# EAGLE design M111B (EAGLE 6.6.0)
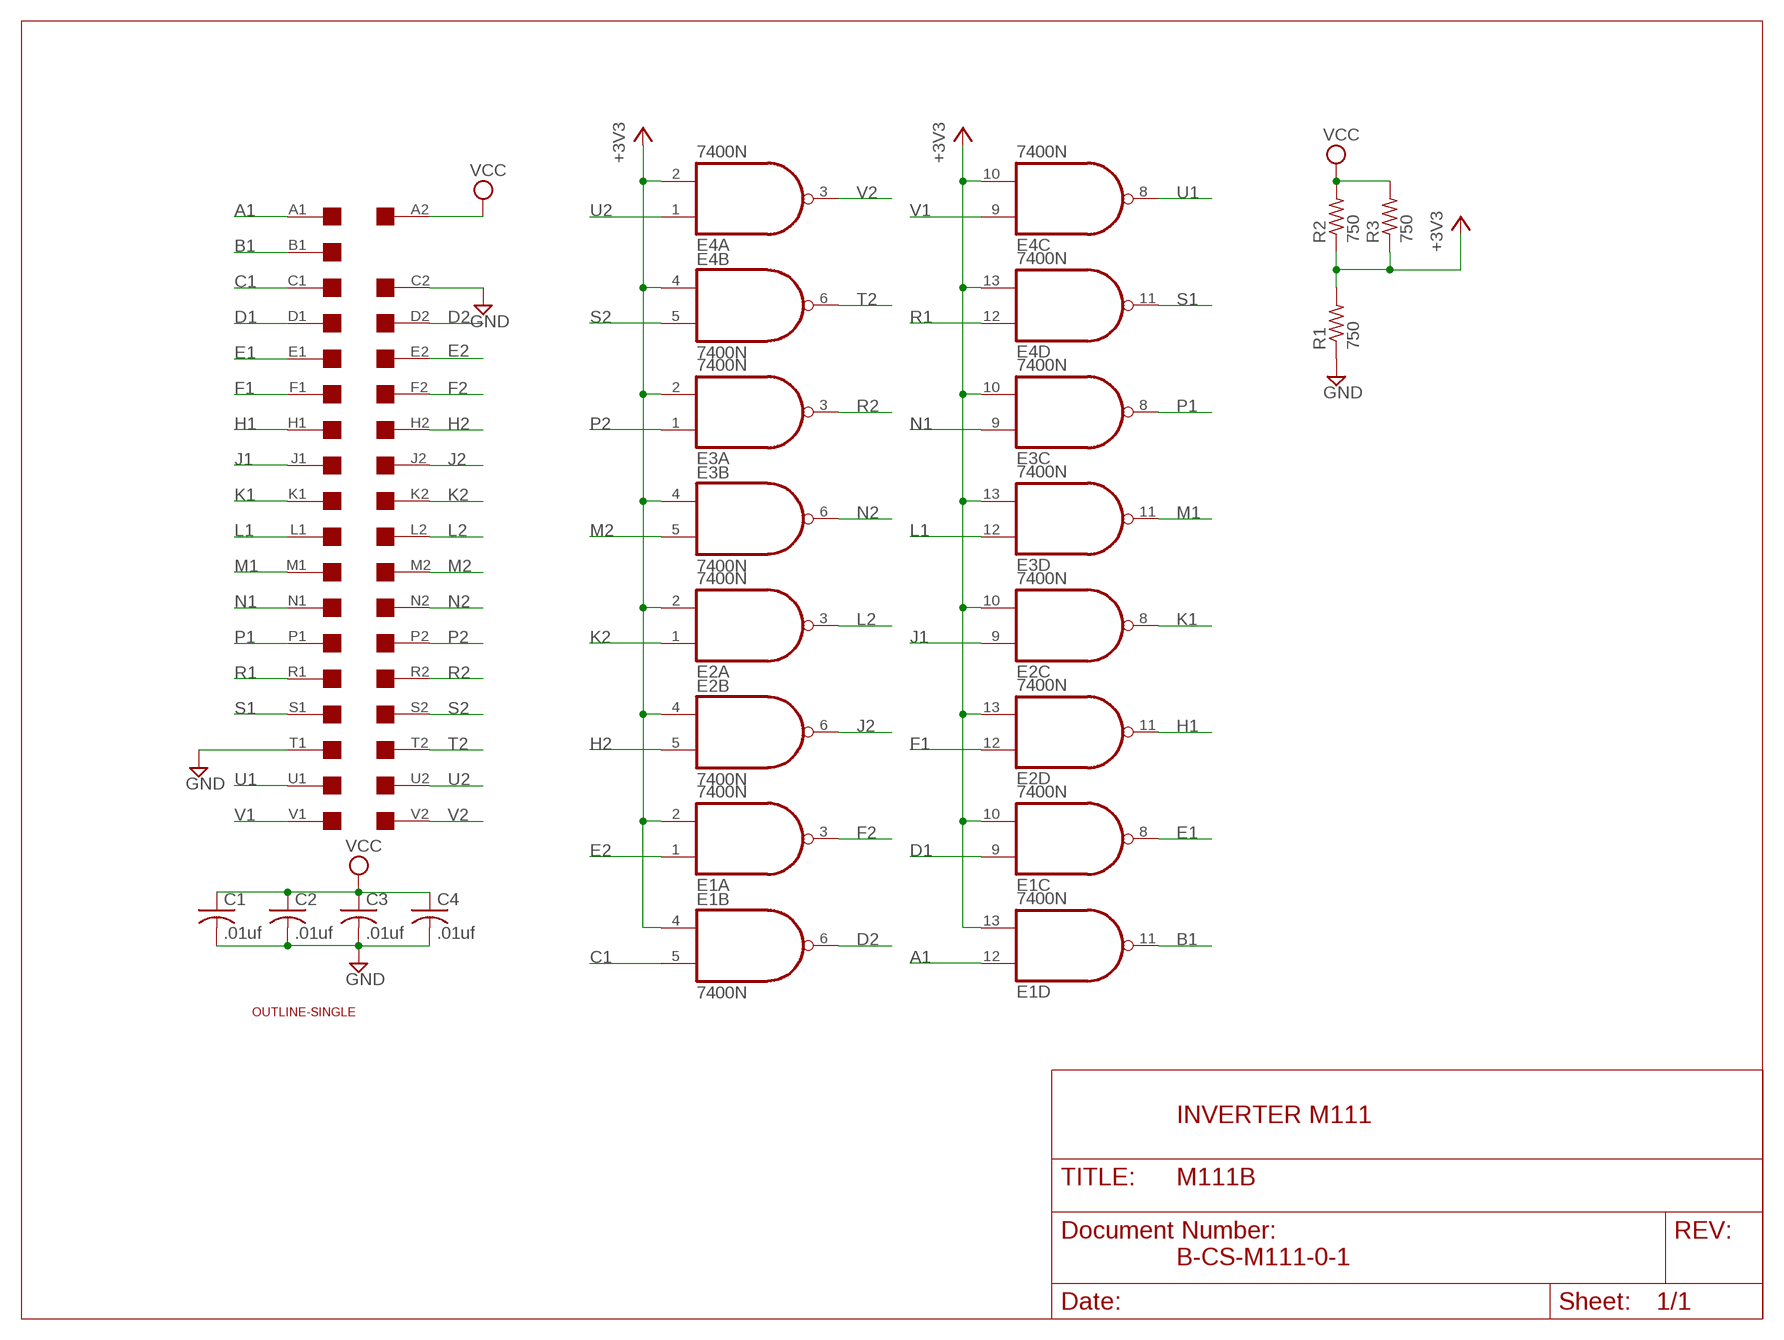
[diagram p0: schematic, sheet 1]

## Parts
A  EDGE-2CONNECTOR  [EDGE-CON2]
C1  .01uf  C-US050-025X075  [C050-025X075]
C2  .01uf  C-US050-025X075  [C050-025X075]
C3  .01uf  C-US050-025X075  [C050-025X075]
C4  .01uf  C-US050-025X075  [C050-025X075]
E1  7400N  [DIL14]
E2  7400N  [DIL14]
E3  7400N  [DIL14]
E4  7400N  [DIL14]
R1  750  R-US_0207/10  [0207/10]
R2  750  R-US_0207/10  [0207/10]
R3  750  R-US_0207/10  [0207/10]
U$1  OUTLINE-SINGLE  [SINGLE]

## Nets
+3V3: E1.2(A:I1) E1.4(B:I0) E1.10(C:I1) E1.13(D:I1) E2.2(A:I1) E2.4(B:I0) E2.10(C:I1) E2.13(D:I1) E3.2(A:I1) E3.4(B:I0) E3.10(C:I1) E3.13(D:I1) E4.2(A:I1) E4.4(B:I0) E4.10(C:I1) E4.13(D:I1) R1.2 R2.1 R3.1
A1: A.A1 E1.12(D:I0)
B1: A.B1 E1.11(D:O)
C1: A.C1 E1.5(B:I1)
D1: A.D1 E1.9(C:I0)
D2: A.D2 E1.6(B:O)
E1: A.E1 E1.8(C:O)
E2: A.E2 E1.1(A:I0)
F1: A.F1 E2.12(D:I0)
F2: A.F2 E1.3(A:O)
GND [Supply]: A.C2 A.T1 C1.2 C2.2 C3.2 C4.2 R1.1
H1: A.H1 E2.11(D:O)
H2: A.H2 E2.5(B:I1)
J1: A.J1 E2.9(C:I0)
J2: A.J2 E2.6(B:O)
K1: A.K1 E2.8(C:O)
K2: A.K2 E2.1(A:I0)
L1: A.L1 E3.12(D:I0)
L2: A.L2 E2.3(A:O)
M1: A.M1 E3.11(D:O)
M2: A.M2 E3.5(B:I1)
N1: A.N1 E3.9(C:I0)
N2: A.N2 E3.6(B:O)
P1: A.P1 E3.8(C:O)
P2: A.P2 E3.1(A:I0)
R1: A.R1 E4.12(D:I0)
R2: A.R2 E3.3(A:O)
S1: A.S1 E4.11(D:O)
S2: A.S2 E4.5(B:I1)
T2: A.T2 E4.6(B:O)
U1: A.U1 E4.8(C:O)
U2: A.U2 E4.1(A:I0)
V1: A.V1 E4.9(C:I0)
V2: A.V2 E4.3(A:O)
VCC [Supply]: A.A2 C1.1 C2.1 C3.1 C4.1 R2.2 R3.2
Unconnected: A.B2

## Notes on the sheet
- INVERTER M111
- B-CS-M111-0-1

## Power pins joined to a net without a drawn wire
GND: E1.7(P:GND) E2.7(P:GND) E3.7(P:GND) E4.7(P:GND)
VCC: E1.14(P:VCC) E2.14(P:VCC) E3.14(P:VCC) E4.14(P:VCC)

## Library data of the parts
A = dec-con:EDGE-2: Double-Sided DEC edge connector.
C1-C4 = rcl:C-US: CAPACITOR, American symbol
E1-E4 = 74xx-us:74*00: Quad 2-input NAND gate
R1-R3 = rcl:R-US_: RESISTOR, American symbol
U$1 = dec-con:OUTLINE-*: Board outlines for DEC boards.

## Net classes
1 Supply: width 0.813 mm

## Board
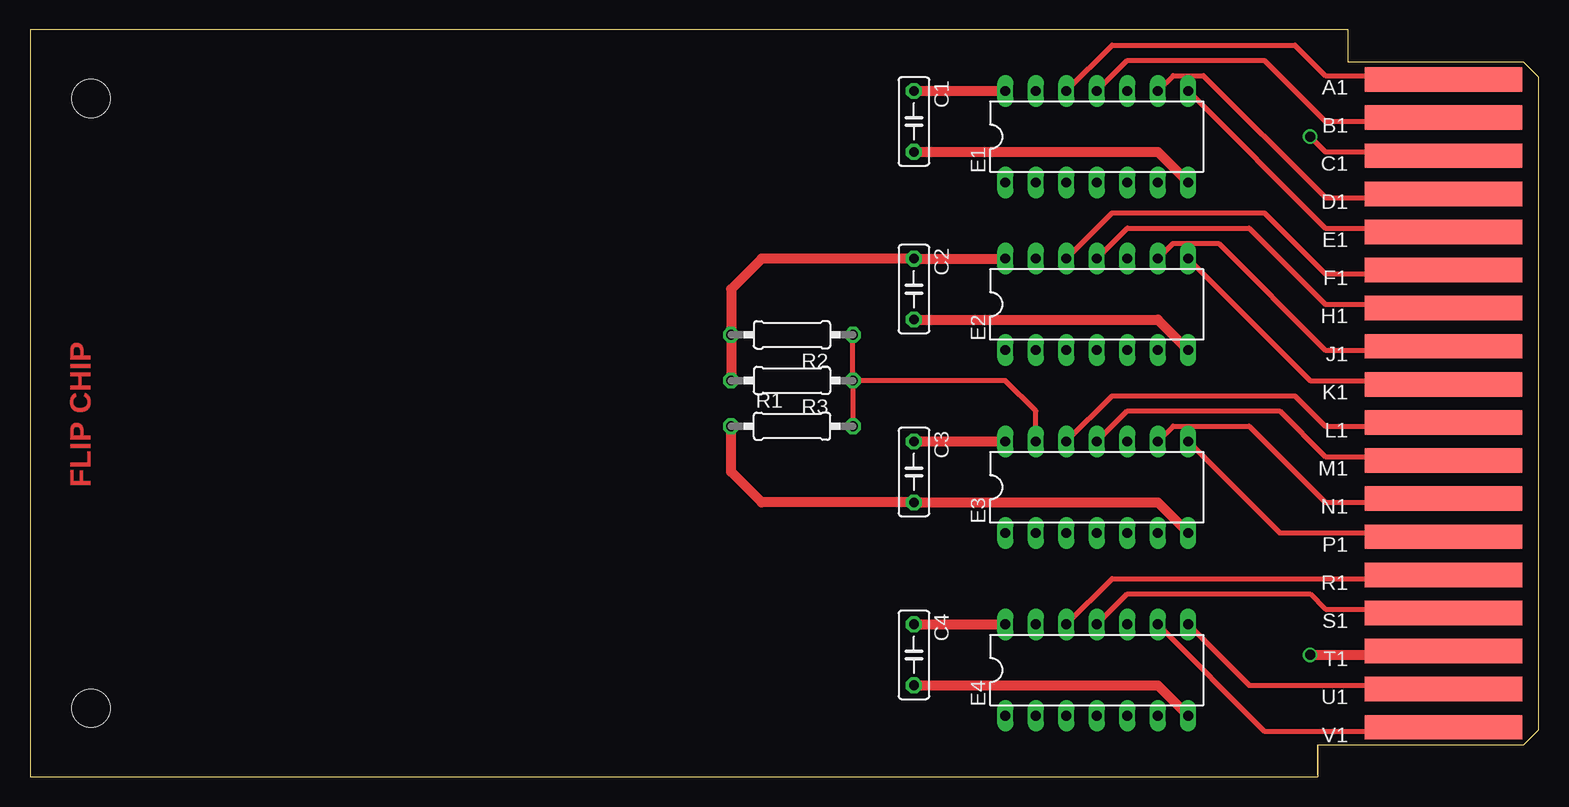
[diagram p1: board, top side]
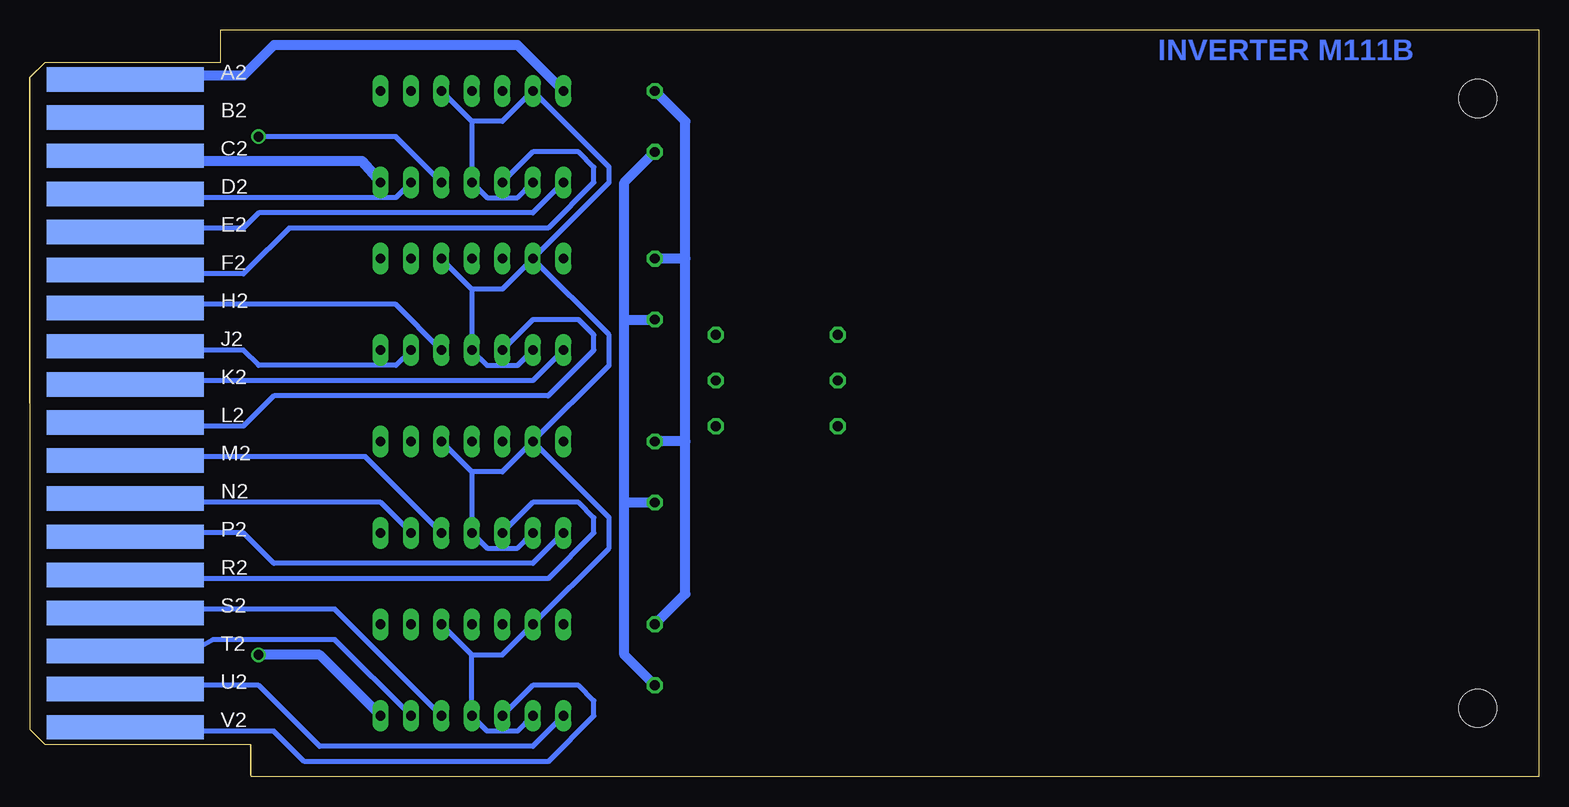
[diagram p2: board, bottom side, seen from below]

Size 125.73 x 62.23 mm. Coordinates in mm from the lower left corner, seen from the top.
Copper layers (1+16): Top 0.035mm / dielectric 1.5mm / Bottom 0.035mm
Design rules "16mils": minimum track width 16mil, minimum drill 32mil, track to track 15mil, track to pad 10mil, pad to pad 10mil, via to via 10mil, smd to smd 10mil, copper to edge 13mil, drill to drill 10mil, minimum pad ring 10mil, minimum via ring 8mil, stop-mask expansion 0mil, vias tented up to drill 0mil, thermal gap 10mil

### Footprints (pad centres in the part's own frame; a part is rotated, then mirrored left to right if it is on the bottom)
EDGE-CON2 = smd 13.106 x 2.032: A1 7.938,4.128; B1 7.938,7.303; C1 7.938,10.477; D1 7.938,13.652; E1 7.938,16.828; F1 7.938,20.003; H1 7.938,23.177; J1 7.938,26.352; K1 7.938,29.527; L1 7.938,32.703; M1 7.938,35.877; N1 7.938,39.053; P1 7.938,42.227; R1 7.938,45.403; S1 7.938,48.578; T1 7.938,51.752; U1 7.938,54.928; V1 7.938,58.102 | smd 13.106 x 2.032 bottom: A2 7.938,4.128; B2 7.938,7.303; C2 7.938,10.477; D2 7.938,13.652; E2 7.938,16.828; F2 7.938,20.003; H2 7.938,23.177; J2 7.938,26.352; K2 7.938,29.527; L2 7.938,32.703; M2 7.938,35.877; N2 7.938,39.053; P2 7.938,42.227; R2 7.938,45.403; S2 7.938,48.578; T2 7.938,51.752; U2 7.938,54.928; V2 7.938,58.102
C050-025X075 = drill 0.813 octagon: 1 -2.54,0; 2 2.54,0
DIL14 = drill 0.813 long: 1 -7.62,-3.81; 2 -5.08,-3.81; 3 -2.54,-3.81; 4 0,-3.81; 5 2.54,-3.81; 6 5.08,-3.81; 7 7.62,-3.81; 8 7.62,3.81; 9 5.08,3.81; 10 2.54,3.81; 11 0,3.81; 12 -2.54,3.81; 13 -5.08,3.81; 14 -7.62,3.81
0207/10 = drill 0.813 octagon: 1 -5.08,0; 2 5.08,0
SINGLE = hole 3.175: 120.65,56.515; 120.65,5.715

### Placement (x,y rotation side)
A  125.73,62.23 180 top
C1  73.66,54.61 270 top
C2  73.66,40.64 270 top
C3  73.66,25.4 270 top
C4  73.66,10.16 270 top
E1  88.9,53.34 0 top
E2  88.9,39.37 0 top
E3  88.9,24.13 0 top
E4  88.9,8.89 0 top
R1  63.5,29.21 0 top
R2  63.5,36.83 180 top
R3  63.5,33.02 180 top
U$1  125.73,62.23 180 top

### Tracks (layer width: path | path; a pad name or v marks a point on that pad's centre or on a via)
+3V3
  Top 0.406: R3.1 R2.1 | R3.1 R1.2 | E3.13 83.82,30.48 81.28,33.02 R3.1
  Bottom 0.406: 88.9,54.61 86.36,54.61 E1.13 77.47,50.8 77.47,49.53 E2.13 | 88.9,54.61 E1.10 | E1.2 85.09,48.26 87.63,48.26 E1.4 88.9,54.61 | E2.13 86.36,40.64 88.9,40.64 | 88.9,40.64 E2.10 | E2.2 85.09,34.29 87.63,34.29 E2.4 88.9,40.64 | E3.13 77.47,34.29 77.47,36.83 E2.13 | E3.13 77.47,21.59 77.47,19.05 E4.13 86.36,10.16 88.9,10.16 | E3.2 85.09,19.05 87.63,19.05 E3.4 88.9,25.4 | E4.2 85.09,3.81 87.63,3.81 E4.4 88.9,10.16 | 88.9,10.16 E4.10 | 88.9,25.4 E3.10 | 88.9,25.4 86.36,25.4 E3.13
A1
  Top 0.406: A.A1 112.16,58.02 111.76,58.42 107.95,58.42 105.41,60.96 90.17,60.96 E1.12
B1
  Top 0.406: A.B1 113.03,54.61 107.95,54.61 102.87,59.69 91.44,59.69 E1.11
C1  (via drill 0.81)
  Top 0.406: A.C1 112.09,51.74 111.76,52.07 107.95,52.07 v106.68,53.34
  Bottom 0.406: v106.68,53.34 95.25,53.34 E1.5
D1
  Top 0.406: A.D1 111.76,48.26 107.95,48.26 107.64,48.56 97.79,58.42 95.25,58.42 E1.9
D2
  Bottom 0.406: A.D2 112.06,48.56 111.76,48.26 95.25,48.26 E1.6
E1
  Top 0.406: A.E1 111.76,45.39 111.76,45.72 107.95,45.72 E1.8
E2
  Bottom 0.406: A.E2 112.09,45.39 111.76,45.72 107.95,45.72 106.68,46.99 83.82,46.99 E1.1
F1
  Top 0.406: A.F1 112.04,42.19 111.76,41.91 107.95,41.91 102.87,46.99 90.17,46.99 E2.12
F2
  Bottom 0.406: A.F2 111.76,41.91 107.95,41.91 107.67,42.19 104.14,45.72 82.55,45.72 78.74,49.53 78.74,50.8 80.01,52.07 83.82,52.07 E1.3
GND  (via drill 0.81)
  Top 0.813: R1.1 58.42,25.4 60.96,22.86 C3.2 93.98,22.86 E3.7 | E2.7 93.98,38.1 C2.2 | E4.7 93.98,7.62 C4.2 | E1.7 93.98,52.07 C1.2 | v106.68,10.16 111.76,10.16 A.T1
  Bottom 0.813: C4.2 76.2,10.16 76.2,22.86 | 76.2,22.86 76.2,38.1 | 76.2,38.1 76.2,49.53 C1.2 | 76.2,38.1 C2.2 | 76.2,22.86 C3.2 | A.C2 112.34,51.74 112.01,51.31 98.04,51.31 E1.7 | v106.68,10.16 101.6,10.16 E4.7
H1
  Top 0.406: A.H1 111.76,39.37 107.95,39.37 101.6,45.72 91.44,45.72 E2.11
H2
  Bottom 0.406: A.H2 112.09,39.04 111.76,39.37 95.25,39.37 E2.5
J1
  Top 0.406: A.J1 111.76,35.56 107.95,35.56 99.06,44.45 95.25,44.45 E2.9
J2
  Bottom 0.406: A.J2 112.09,35.89 111.76,35.56 107.95,35.56 106.68,34.29 95.25,34.29 E2.6
K1
  Top 0.406: A.K1 112.06,32.72 111.76,33.02 106.68,33.02 E2.8
K2
  Bottom 0.406: A.K2 112.06,32.72 111.76,33.02 83.82,33.02 E2.1
L1
  Top 0.406: A.L1 112.09,29.54 111.76,29.21 107.95,29.21 105.41,31.75 90.17,31.75 E3.12
L2
  Bottom 0.406: A.L2 112.09,29.54 111.76,29.21 107.95,29.21 105.41,31.75 82.55,31.75 78.74,35.56 78.74,36.83 80.01,38.1 83.82,38.1 E2.3
M1
  Top 0.406: A.M1 111.76,26.67 107.95,26.67 104.14,30.48 91.44,30.48 E3.11
M2
  Bottom 0.406: A.M2 112.09,26.34 111.76,26.67 97.79,26.67 E3.5
N1
  Top 0.406: A.N1 111.76,22.86 107.95,22.86 107.62,23.19 101.6,29.21 95.25,29.21 E3.9
N2
  Bottom 0.406: A.N2 112.09,23.19 111.76,22.86 96.52,22.86 E3.6
P1
  Top 0.406: A.P1 112.09,19.99 111.76,20.32 104.14,20.32 E3.8
P2
  Bottom 0.406: A.P2 112.09,19.99 111.76,20.32 107.95,20.32 105.41,17.78 83.82,17.78 E3.1
R1
  Top 0.406: A.R1 112.09,16.84 111.76,16.51 90.17,16.51 E4.12
R2
  Bottom 0.406: A.R2 112.09,16.84 111.76,16.51 82.55,16.51 78.74,20.32 78.74,21.59 80.01,22.86 83.82,22.86 E3.3
S1
  Top 0.406: A.S1 112.06,13.66 111.76,13.97 107.95,13.97 106.68,15.24 91.44,15.24 E4.11
S2
  Bottom 0.406: A.S2 112.06,13.66 111.76,13.97 100.33,13.97 100.03,13.66 E4.5
T2
  Bottom 0.406: A.T2 112.09,10.49 110.49,11.43 100.33,11.43 E4.6
U1
  Top 0.406: A.U1 112.12,7.26 111.76,7.62 101.6,7.62 E4.8
U2
  Bottom 0.406: A.U2 112.12,7.26 111.76,7.62 106.68,7.62 101.6,2.54 83.82,2.54 E4.1
V1
  Top 0.406: A.V1 113.91,4.2 113.03,3.81 102.87,3.81 E4.9
V2
  Bottom 0.406: A.V2 112.15,4.2 111.76,3.81 105.41,3.81 102.87,1.27 82.55,1.27 78.74,5.08 78.74,6.35 80.01,7.62 83.82,7.62 E4.3
VCC
  Top 0.813: C1.1 E1.14 | E2.14 C2.1 60.96,43.18 58.42,40.64 R2.2 R3.2 | C3.1 E3.14 | C4.1 E4.14
  Bottom 0.813: A.A2 112.16,58.02 111.76,58.42 107.95,58.42 105.41,60.96 85.09,60.96 E1.14 | C1.1 71.12,54.61 71.12,43.18 | 71.12,27.94 71.12,15.24 C4.1 | 71.12,27.94 71.12,43.18 | 71.12,27.94 C3.1 | 71.12,43.18 C2.1

### Text on the board
Top: FLIP CHIP
Bottom: INVERTER M111B